# Altium schematic sheet USB Distribution.SchDoc: DO NOT FILL THIS IN
size Tabloid; Date: DO NOT FILL THIS IN; ApprovedBy: DO NOT FILL THIS IN; CheckedBy: DO NOT FILL THIS IN; Author: DO NOT FILL THIS IN; CompanyName: DO NOT FILL THIS IN; DrawnBy: DO NOT FILL THIS IN; Engineer: DO NOT FILL THIS IN; Organization: DO NOT FILL THIS IN; Address1: DO NOT FILL THIS IN; Address2: DO NOT FILL THIS IN; Address3: DO NOT FILL THIS IN; Address4: DO NOT FILL THIS IN; DocumentNumber: DO NOT FILL THIS IN; Revision: DO NOT FILL THIS IN; SheetNumber: 4; SheetTotal: 9; PageSetup: Record=PageOptions|CenterHorizontal=True|CenterVertical=True|PrintScale=1.00|XCorrection=1.00|YCorrection=1.00|PrintKind=1|BorderSize=5000000|LeftOffset=0|BottomOffset=0|Orientation=2|PaperLength=1000|PaperWidth=1000|Scale=100|PaperSource=7|PrintQuality=-4|MediaType=1|DitherType=10|PaperKind=Ledger|PrintScaleMode=1; cpr-ItemNumber: 025619; cpr-ItemName1: TurtleBot4 UI board; cpr-ItemName2: Rev 2; cpr-Revision: 2; cpr-SheetNumber: 4; cpr-SheetTotal: 9; cpr-Draft: AG; cpr-DraftDate: 19/04/2022; cpr-Rigour1: XXX; cpr-Rigour2: XXX; cpr-Rigour1Date: XXX; cpr-Rigour2Date: XXX; Time: DO NOT FILL THIS IN; ImagePath: DO NOT FILL THIS IN; Application_BuildNumber: DO NOT FILL THIS IN
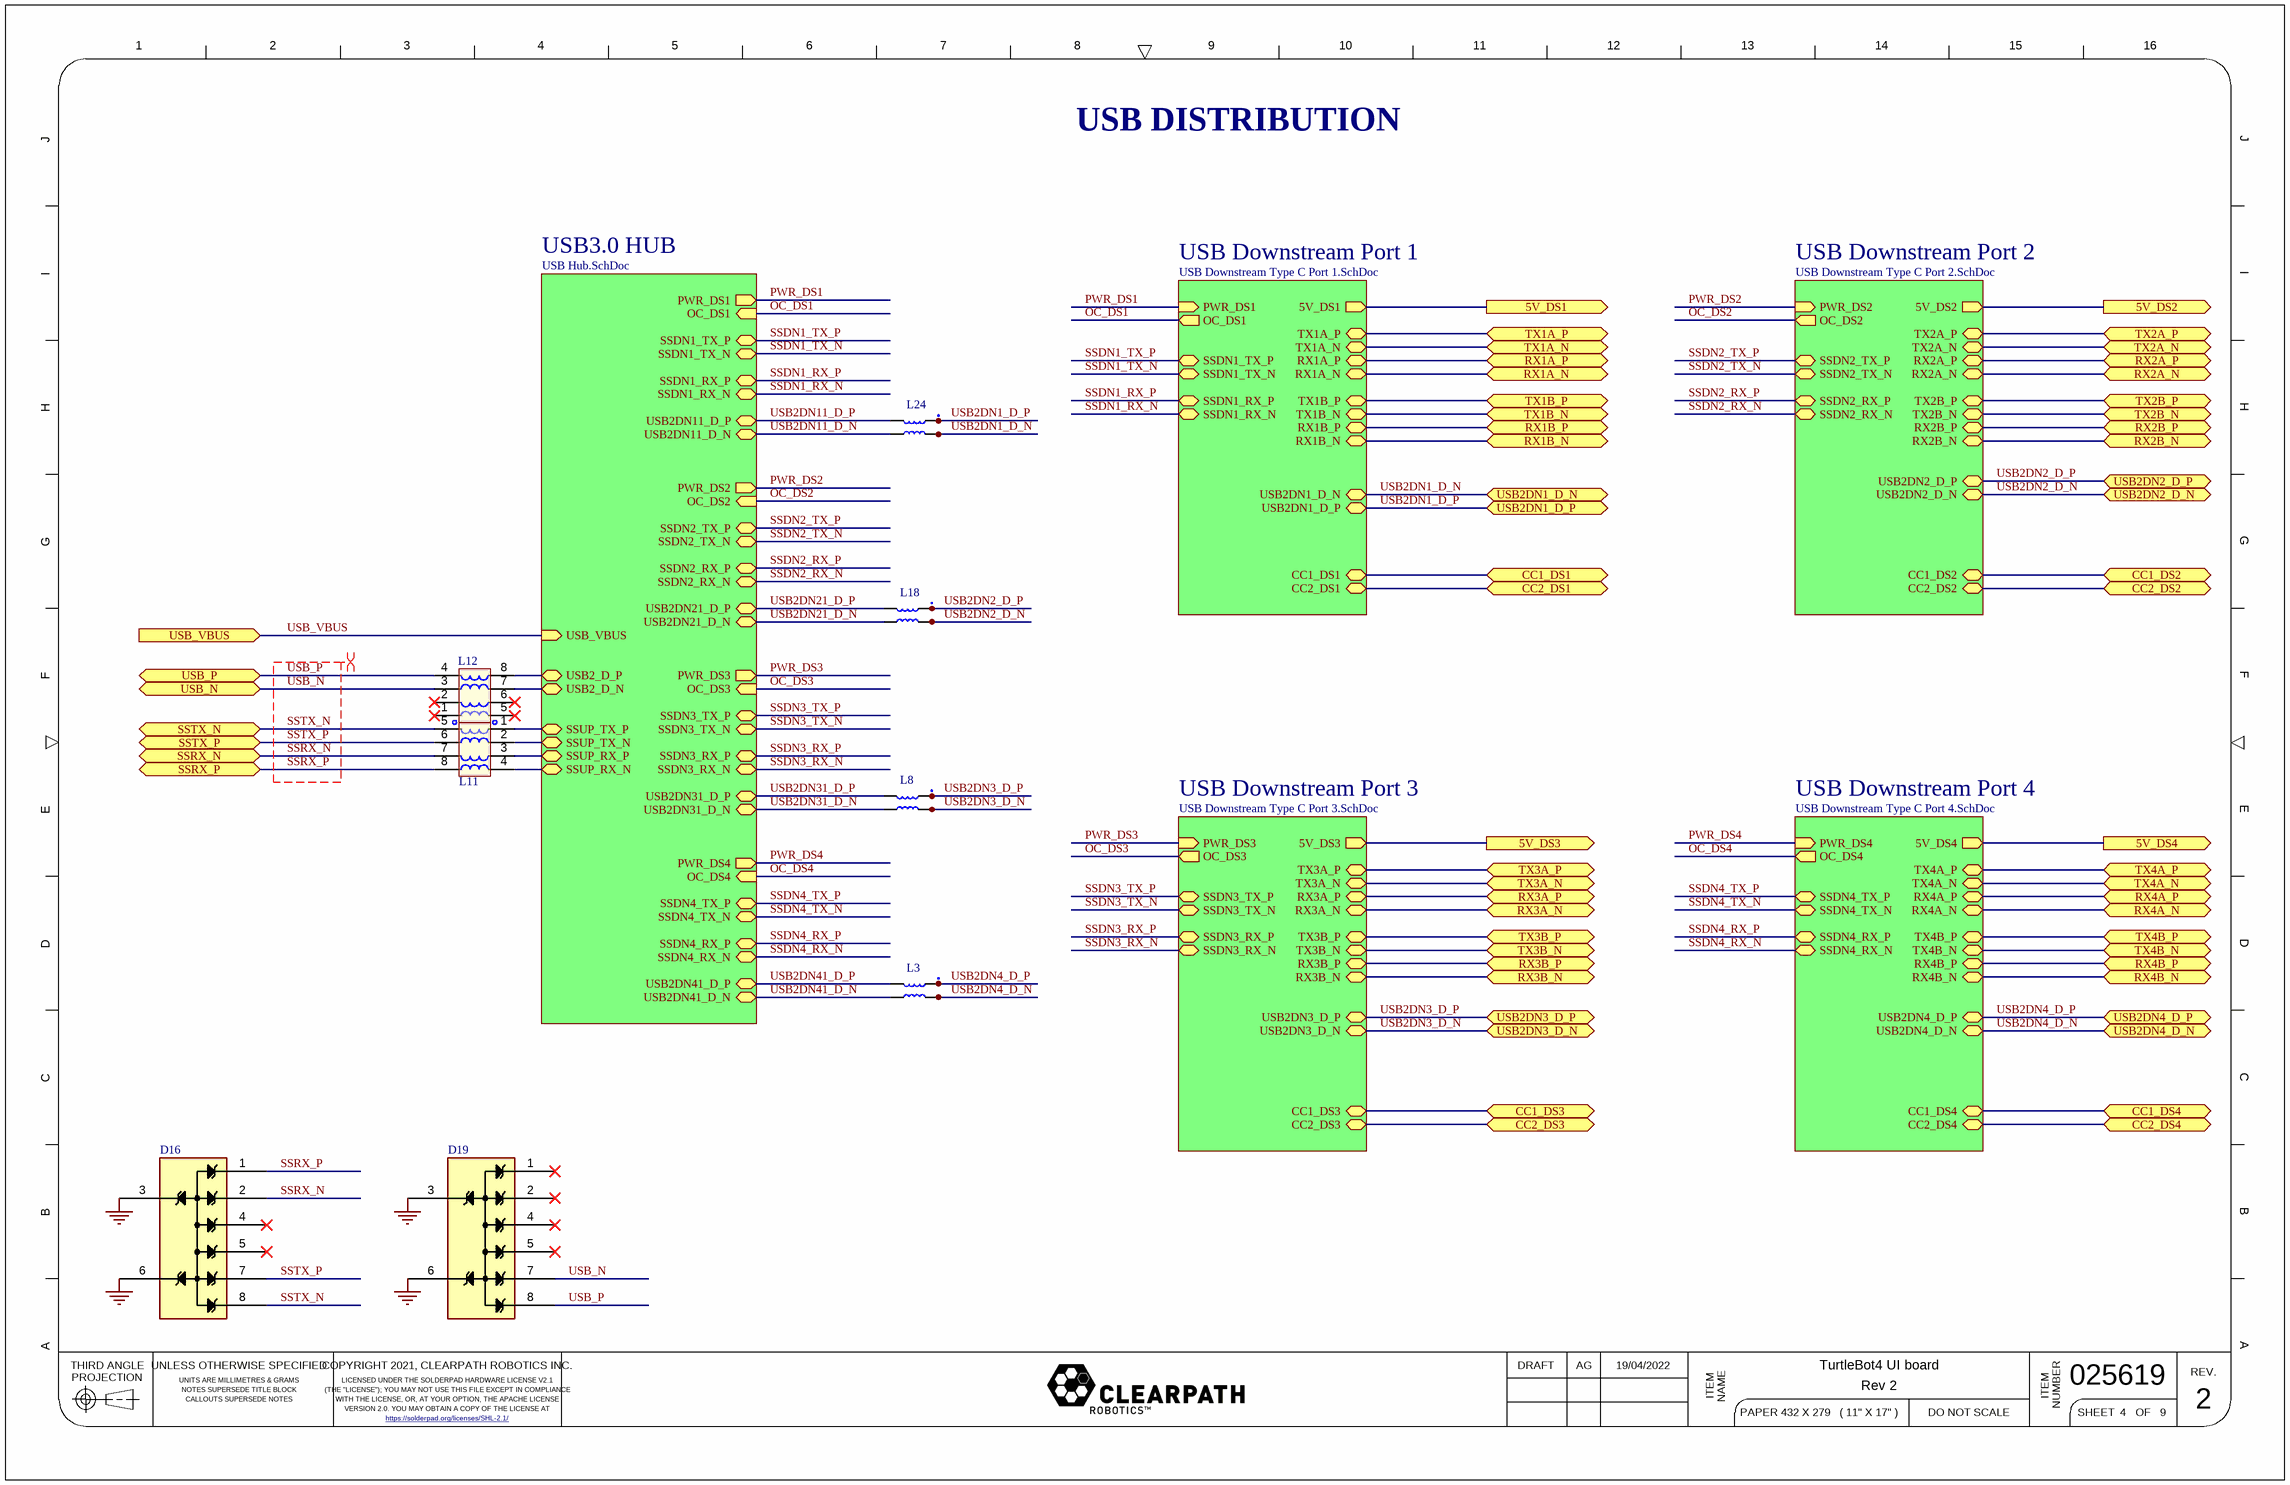
[diagram p0: USB Distribution.SchDoc]

## Parts
D16  ESD7016  [ESD7016]  (value not drawn)
D19  ESD7016  [ESD7016]  (value not drawn)
L3  CMC 100MA 2LN 90 OHM SMD2  [MCZ1210CH900L2]  (value not drawn)
L8  CMC 100MA 2LN 90 OHM SMD2  [MCZ1210CH900L2]  (value not drawn)
L11  CMC 120MA 4LN 90 OHM SMD  [FIL_DLP2ADA900HL4L]  (value not drawn)
L12  CMC 120MA 4LN 90 OHM SMD  [FIL_DLP2ADA900HL4L]  (value not drawn)
L18  CMC 100MA 2LN 90 OHM SMD2  [MCZ1210CH900L2]  (value not drawn)
L24  CMC 100MA 2LN 90 OHM SMD2  [MCZ1210CH900L2]  (value not drawn)

## Sub-sheets
USB3.0 HUB = USB Hub.SchDoc: SSDN1_TX_N (bidir), SSDN1_TX_P (bidir), SSDN1_RX_P (bidir), SSDN1_RX_N (bidir), USB2DN11_D_P (bidir), USB2DN11_D_N (bidir), SSDN2_TX_N (bidir), SSDN2_TX_P (bidir), SSDN2_RX_P (bidir), SSDN2_RX_N (bidir), USB2DN21_D_P (bidir), USB2DN21_D_N (bidir), SSDN3_TX_N (bidir), SSDN3_TX_P (bidir), SSDN3_RX_P (bidir), SSDN3_RX_N (bidir), USB2DN31_D_P (bidir), USB2DN31_D_N (bidir), SSDN4_TX_N (bidir), SSDN4_TX_P (bidir), SSDN4_RX_P (bidir), SSDN4_RX_N (bidir), USB2DN41_D_P (bidir), USB2DN41_D_N (bidir), PWR_DS1 (out), PWR_DS2 (out), PWR_DS3 (out), PWR_DS4 (out), OC_DS1 (in), OC_DS2 (in), OC_DS3 (in), OC_DS4 (in), SSUP_TX_N (bidir), USB2_D_N (bidir), USB2_D_P (bidir), SSUP_TX_P (bidir), SSUP_RX_N (bidir), SSUP_RX_P (bidir), USB_VBUS (in)
USB Downstream Port 1 = USB Downstream Type C Port 1.SchDoc: SSDN1_TX_N (bidir), SSDN1_TX_P (bidir), SSDN1_RX_P (bidir), SSDN1_RX_N (bidir), USB2DN1_D_P (bidir), USB2DN1_D_N (bidir), PWR_DS1 (in), OC_DS1 (out), RX1A_N (bidir), TX1B_N (bidir), TX1B_P (bidir), CC2_DS1 (bidir), CC1_DS1 (bidir), TX1A_N (bidir), 5V_DS1 (out), TX1A_P (bidir), RX1B_P (bidir), RX1B_N (bidir), RX1A_P (bidir)
USB Downstream Port 2 = USB Downstream Type C Port 2.SchDoc: SSDN2_TX_N (bidir), SSDN2_TX_P (bidir), SSDN2_RX_P (bidir), SSDN2_RX_N (bidir), PWR_DS2 (in), OC_DS2 (out), RX2B_P (bidir), RX2B_N (bidir), TX2B_N (bidir), TX2B_P (bidir), CC1_DS2 (bidir), USB2DN2_D_N (bidir), RX2A_P (bidir), RX2A_N (bidir), USB2DN2_D_P (bidir), CC2_DS2 (bidir), TX2A_N (bidir), TX2A_P (bidir), 5V_DS2 (out)
USB Downstream Port 3 = USB Downstream Type C Port 3.SchDoc: SSDN3_TX_N (bidir), SSDN3_TX_P (bidir), SSDN3_RX_P (bidir), SSDN3_RX_N (bidir), PWR_DS3 (in), OC_DS3 (out), RX3A_P (bidir), CC2_DS3 (bidir), 5V_DS3 (out), TX3A_P (bidir), TX3A_N (bidir), CC1_DS3 (bidir), USB2DN3_D_N (bidir), USB2DN3_D_P (bidir), RX3A_N (bidir), RX3B_P (bidir), RX3B_N (bidir), TX3B_P (bidir), TX3B_N (bidir)
USB Downstream Port 4 = USB Downstream Type C Port 4.SchDoc: SSDN4_TX_N (bidir), SSDN4_TX_P (bidir), SSDN4_RX_P (bidir), SSDN4_RX_N (bidir), PWR_DS4 (in), OC_DS4 (out), 5V_DS4 (out), RX4A_P (bidir), TX4A_P (bidir), USB2DN4_D_P (bidir), RX4B_N (bidir), CC2_DS4 (bidir), RX4B_P (bidir), TX4B_P (bidir), RX4A_N (bidir), TX4A_N (bidir), CC1_DS4 (bidir), TX4B_N (bidir), USB2DN4_D_N (bidir)

## Ports
5V_DS1 (out), 5V_DS2 (out), 5V_DS3 (out), 5V_DS4 (out), CC1_DS1 (bidir), CC1_DS2 (bidir), CC1_DS3 (bidir), CC1_DS4 (bidir), CC2_DS1 (bidir), CC2_DS2 (bidir), CC2_DS3 (bidir), CC2_DS4 (bidir), RX1A_N (bidir), RX1A_P (bidir), RX1B_N (bidir), RX1B_P (bidir), RX2A_N (bidir), RX2A_P (bidir), RX2B_N (bidir), RX2B_P (bidir), RX3A_N (bidir), RX3A_P (bidir), RX3B_N (bidir), RX3B_P (bidir), RX4A_N (bidir), RX4A_P (bidir), RX4B_N (bidir), RX4B_P (bidir), SSRX_N (bidir), SSRX_P (bidir), SSTX_N (bidir), SSTX_P (bidir), TX1A_N (bidir), TX1A_P (bidir), TX1B_N (bidir), TX1B_P (bidir), TX2A_N (bidir), TX2A_P (bidir), TX2B_N (bidir), TX2B_P (bidir), TX3A_N (bidir), TX3A_P (bidir), TX3B_N (bidir), TX3B_P (bidir), TX4A_N (bidir), TX4A_P (bidir), TX4B_N (bidir), TX4B_P (bidir), USB2DN1_D_N (bidir), USB2DN1_D_P (bidir), USB2DN2_D_N (bidir), USB2DN2_D_P (bidir), USB2DN3_D_N (bidir), USB2DN3_D_P (bidir), USB2DN4_D_N (bidir), USB2DN4_D_P (bidir), USB_N (bidir), USB_P (bidir), USB_VBUS (in)

## Nets
GND: D16.3 D16.6 D19.3 D19.6
5V_DS1: port 5V_DS1, sheet USB Downstream Port 1/5V_DS1
5V_DS2: port 5V_DS2, sheet USB Downstream Port 2/5V_DS2
5V_DS3: port 5V_DS3, sheet USB Downstream Port 3/5V_DS3
5V_DS4: port 5V_DS4, sheet USB Downstream Port 4/5V_DS4
CC1_DS1: port CC1_DS1, sheet USB Downstream Port 1/CC1_DS1
CC1_DS2: port CC1_DS2, sheet USB Downstream Port 2/CC1_DS2
CC1_DS3: port CC1_DS3, sheet USB Downstream Port 3/CC1_DS3
CC1_DS4: port CC1_DS4, sheet USB Downstream Port 4/CC1_DS4
CC2_DS1: port CC2_DS1, sheet USB Downstream Port 1/CC2_DS1
CC2_DS2: port CC2_DS2, sheet USB Downstream Port 2/CC2_DS2
CC2_DS3: port CC2_DS3, sheet USB Downstream Port 3/CC2_DS3
CC2_DS4: port CC2_DS4, sheet USB Downstream Port 4/CC2_DS4
OC_DS1: sheet USB3.0 HUB/OC_DS1, sheet USB Downstream Port 1/OC_DS1
OC_DS2: sheet USB Downstream Port 2/OC_DS2, sheet USB3.0 HUB/OC_DS2
OC_DS3: sheet USB Downstream Port 3/OC_DS3, sheet USB3.0 HUB/OC_DS3
OC_DS4: sheet USB Downstream Port 4/OC_DS4, sheet USB3.0 HUB/OC_DS4
PWR_DS1: sheet USB3.0 HUB/PWR_DS1, sheet USB Downstream Port 1/PWR_DS1
PWR_DS2: sheet USB Downstream Port 2/PWR_DS2, sheet USB3.0 HUB/PWR_DS2
PWR_DS3: sheet USB Downstream Port 3/PWR_DS3, sheet USB3.0 HUB/PWR_DS3
PWR_DS4: sheet USB Downstream Port 4/PWR_DS4, sheet USB3.0 HUB/PWR_DS4
RX1A_N: port RX1A_N, sheet USB Downstream Port 1/RX1A_N
RX1A_P: port RX1A_P, sheet USB Downstream Port 1/RX1A_P
RX1B_N: port RX1B_N, sheet USB Downstream Port 1/RX1B_N
RX1B_P: port RX1B_P, sheet USB Downstream Port 1/RX1B_P
RX2A_N: port RX2A_N, sheet USB Downstream Port 2/RX2A_N
RX2A_P: port RX2A_P, sheet USB Downstream Port 2/RX2A_P
RX2B_N: port RX2B_N, sheet USB Downstream Port 2/RX2B_N
RX2B_P: port RX2B_P, sheet USB Downstream Port 2/RX2B_P
RX3A_N: port RX3A_N, sheet USB Downstream Port 3/RX3A_N
RX3A_P: port RX3A_P, sheet USB Downstream Port 3/RX3A_P
RX3B_N: port RX3B_N, sheet USB Downstream Port 3/RX3B_N
RX3B_P: port RX3B_P, sheet USB Downstream Port 3/RX3B_P
RX4A_N: port RX4A_N, sheet USB Downstream Port 4/RX4A_N
RX4A_P: port RX4A_P, sheet USB Downstream Port 4/RX4A_P
RX4B_N: port RX4B_N, sheet USB Downstream Port 4/RX4B_N
RX4B_P: port RX4B_P, sheet USB Downstream Port 4/RX4B_P
SSDN1_RX_N: sheet USB3.0 HUB/SSDN1_RX_N, sheet USB Downstream Port 1/SSDN1_RX_N
SSDN1_RX_P: sheet USB3.0 HUB/SSDN1_RX_P, sheet USB Downstream Port 1/SSDN1_RX_P
SSDN1_TX_N: sheet USB3.0 HUB/SSDN1_TX_N, sheet USB Downstream Port 1/SSDN1_TX_N
SSDN1_TX_P: sheet USB3.0 HUB/SSDN1_TX_P, sheet USB Downstream Port 1/SSDN1_TX_P
SSDN2_RX_N: sheet USB Downstream Port 2/SSDN2_RX_N, sheet USB3.0 HUB/SSDN2_RX_N
SSDN2_RX_P: sheet USB Downstream Port 2/SSDN2_RX_P, sheet USB3.0 HUB/SSDN2_RX_P
SSDN2_TX_N: sheet USB Downstream Port 2/SSDN2_TX_N, sheet USB3.0 HUB/SSDN2_TX_N
SSDN2_TX_P: sheet USB Downstream Port 2/SSDN2_TX_P, sheet USB3.0 HUB/SSDN2_TX_P
SSDN3_RX_N: sheet USB Downstream Port 3/SSDN3_RX_N, sheet USB3.0 HUB/SSDN3_RX_N
SSDN3_RX_P: sheet USB Downstream Port 3/SSDN3_RX_P, sheet USB3.0 HUB/SSDN3_RX_P
SSDN3_TX_N: sheet USB Downstream Port 3/SSDN3_TX_N, sheet USB3.0 HUB/SSDN3_TX_N
SSDN3_TX_P: sheet USB Downstream Port 3/SSDN3_TX_P, sheet USB3.0 HUB/SSDN3_TX_P
SSDN4_RX_N: sheet USB Downstream Port 4/SSDN4_RX_N, sheet USB3.0 HUB/SSDN4_RX_N
SSDN4_RX_P: sheet USB Downstream Port 4/SSDN4_RX_P, sheet USB3.0 HUB/SSDN4_RX_P
SSDN4_TX_N: sheet USB Downstream Port 4/SSDN4_TX_N, sheet USB3.0 HUB/SSDN4_TX_N
SSDN4_TX_P: sheet USB Downstream Port 4/SSDN4_TX_P, sheet USB3.0 HUB/SSDN4_TX_P
SSRX_N: D16.2 L11.7 ; port SSRX_N
SSRX_P: D16.1 L11.8 ; port SSRX_P
SSTX_N: D16.8 L11.5 ; port SSTX_N
SSTX_P: D16.7 L11.6 ; port SSTX_P
TX1A_N: port TX1A_N, sheet USB Downstream Port 1/TX1A_N
TX1A_P: port TX1A_P, sheet USB Downstream Port 1/TX1A_P
TX1B_N: port TX1B_N, sheet USB Downstream Port 1/TX1B_N
TX1B_P: port TX1B_P, sheet USB Downstream Port 1/TX1B_P
TX2A_N: port TX2A_N, sheet USB Downstream Port 2/TX2A_N
TX2A_P: port TX2A_P, sheet USB Downstream Port 2/TX2A_P
TX2B_N: port TX2B_N, sheet USB Downstream Port 2/TX2B_N
TX2B_P: port TX2B_P, sheet USB Downstream Port 2/TX2B_P
TX3A_N: port TX3A_N, sheet USB Downstream Port 3/TX3A_N
TX3A_P: port TX3A_P, sheet USB Downstream Port 3/TX3A_P
TX3B_N: port TX3B_N, sheet USB Downstream Port 3/TX3B_N
TX3B_P: port TX3B_P, sheet USB Downstream Port 3/TX3B_P
TX4A_N: port TX4A_N, sheet USB Downstream Port 4/TX4A_N
TX4A_P: port TX4A_P, sheet USB Downstream Port 4/TX4A_P
TX4B_N: port TX4B_N, sheet USB Downstream Port 4/TX4B_N
TX4B_P: port TX4B_P, sheet USB Downstream Port 4/TX4B_P
USB2DN1_D_N: L24.2 ; port USB2DN1_D_N, sheet USB Downstream Port 1/USB2DN1_D_N
USB2DN1_D_P: L24.1 ; port USB2DN1_D_P, sheet USB Downstream Port 1/USB2DN1_D_P
USB2DN2_D_N: L18.2 ; port USB2DN2_D_N, sheet USB Downstream Port 2/USB2DN2_D_N
USB2DN2_D_P: L18.1 ; port USB2DN2_D_P, sheet USB Downstream Port 2/USB2DN2_D_P
USB2DN3_D_N: L8.2 ; port USB2DN3_D_N, sheet USB Downstream Port 3/USB2DN3_D_N
USB2DN3_D_P: L8.1 ; port USB2DN3_D_P, sheet USB Downstream Port 3/USB2DN3_D_P
USB2DN4_D_N: L3.2 ; port USB2DN4_D_N, sheet USB Downstream Port 4/USB2DN4_D_N
USB2DN4_D_P: L3.1 ; port USB2DN4_D_P, sheet USB Downstream Port 4/USB2DN4_D_P
USB2DN11_D_N: L24.3 ; sheet USB3.0 HUB/USB2DN11_D_N
USB2DN11_D_P: L24.4 ; sheet USB3.0 HUB/USB2DN11_D_P
USB2DN21_D_N: L18.3 ; sheet USB3.0 HUB/USB2DN21_D_N
USB2DN21_D_P: L18.4 ; sheet USB3.0 HUB/USB2DN21_D_P
USB2DN31_D_N: L8.3 ; sheet USB3.0 HUB/USB2DN31_D_N
USB2DN31_D_P: L8.4 ; sheet USB3.0 HUB/USB2DN31_D_P
USB2DN41_D_N: L3.3 ; sheet USB3.0 HUB/USB2DN41_D_N
USB2DN41_D_P: L3.4 ; sheet USB3.0 HUB/USB2DN41_D_P
USB_N: D19.7 L12.3 ; port USB_N
USB_P: D19.8 L12.4 ; port USB_P
USB_VBUS: port USB_VBUS, sheet USB3.0 HUB/USB_VBUS
NetL11_1: L11.1 ; sheet USB3.0 HUB/SSUP_TX_P
NetL11_2: L11.2 ; sheet USB3.0 HUB/SSUP_TX_N
NetL11_3: L11.3 ; sheet USB3.0 HUB/SSUP_RX_P
NetL11_4: L11.4 ; sheet USB3.0 HUB/SSUP_RX_N
NetL12_7: L12.7 ; sheet USB3.0 HUB/USB2_D_N
NetL12_8: L12.8 ; sheet USB3.0 HUB/USB2_D_P

Not connected (* = marked no-connect by the designer): D16 4* 5*; D19 1* 2* 4* 5*; L12 1* 2* 5* 6*

## Layout directives
differential pair; net class USB3; differential pair class DIFF90; rule Matched Net Lengths [Tolerance = 15mil]: SSRX_N, SSRX_P, SSTX_N, SSTX_P, USB_N, USB_P

## Notes on the sheet
- USB DISTRIBUTION
- 1
- 2
- 3
- 4
- 5
- 6
- 7
- 8
- 9
- 10
- 11
- 12
- 13
- 14
- 15
- 16
- J
- I
- H
- G
- F
- E
- D
- C
- B
- A
- THIRD ANGLE
- PROJECTION
- UNLESS OTHERWISE SPECIFIED
- COPYRIGHT 2021, CLEARPATH ROBOTICS INC.
- DRAFT
- REV.
- UNITS ARE MILLIMETRES & GRAMS
- NOTES SUPERSEDE TITLE BLOCK
- CALLOUTS SUPERSEDE NOTES
- LICENSED UNDER THE SOLDERPAD HARDWARE LICENSE V2.1
- (THE "LICENSE"); YOU MAY NOT USE THIS FILE EXCEPT IN COMPLIANCE
- WITH THE LICENSE, OR, AT YOUR OPTION, THE APACHE LICENSE
- VERSION 2.0. YOU MAY OBTAIN A COPY OF THE LICENSE AT
- https://solderpad.org/licenses/SHL-2.1/ <https://solderpad.https://solderpad.org/licenses/SHL-2.1/org/licenses/SHL-2.1/>
- ITEM
- NAME
- PAPER 432 X 279   ( 11" X 17" )
- DO NOT SCALE
- NUMBER
- SHEET
- OF

## Library data of the parts
D16 D19 = ESD7016: USB3 TVS diode assy; Vendor 1: Digikey; Vendor 1 PN: ESD7016MUTAGOSCT-ND; Mfg: ON Semi; Mfg PN: ESD7016MUTAG; Vendor 2 PN: *; Vendor 2: *
L3 L8 L18 L24 = CMC 90_Ohms: Line Common Mode Choke Surface Mount 90 Ohms 100mA DCR 5Ohm; Supplier 1: Digi-Key; Supplier Part Number 1: 490-16595-1-ND
L11 L12 = DLP2ADA900HL4L: Chip Common Mode Choke Coil Arrays; Package: None; Price: None; Value: *; MP: DLP2ADA900HL4L; Availability: Unavailable; Supplier 1: Digi-Key; Supplier Part Number 1: 490-11096-1-ND